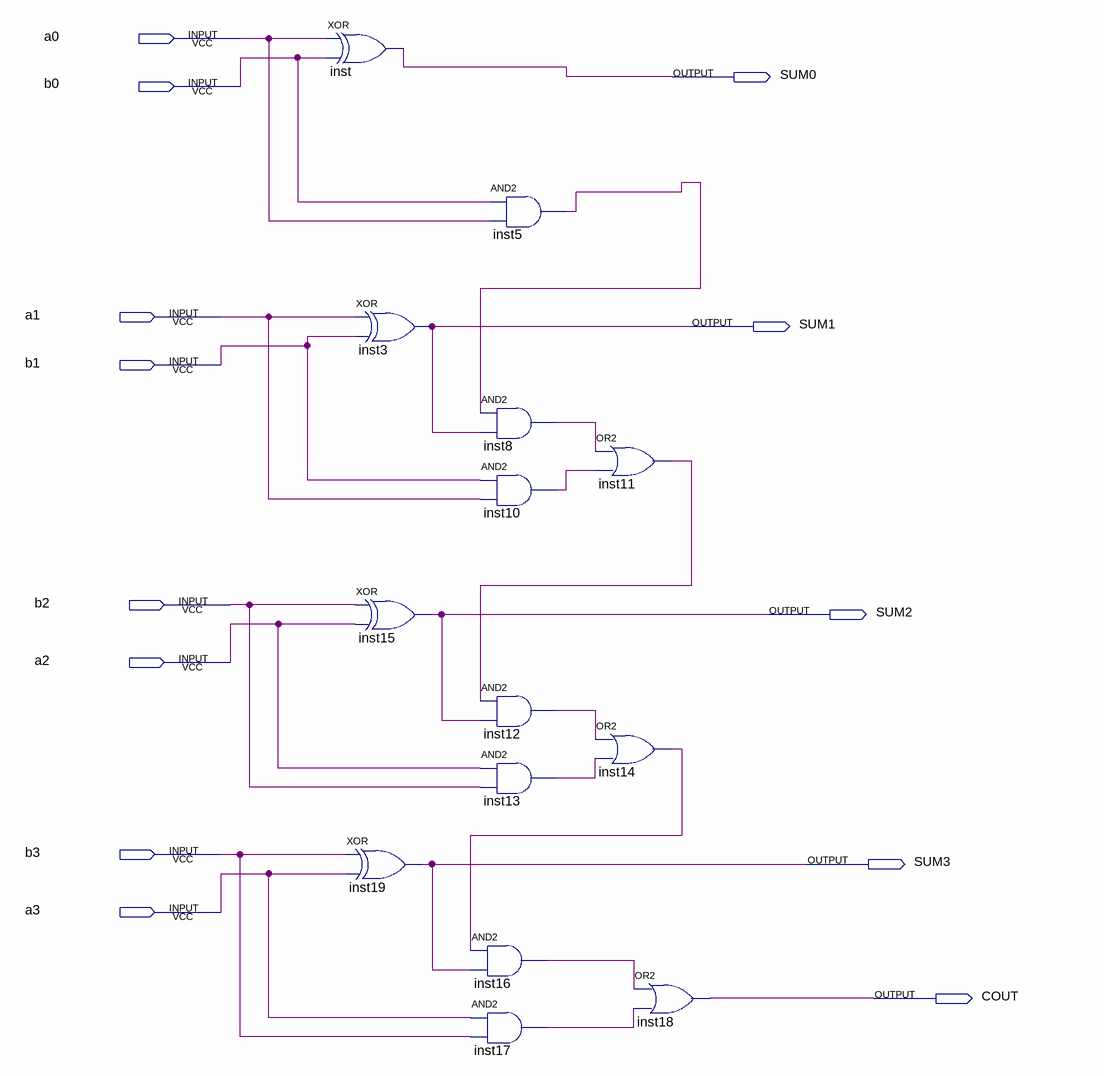
[diagram p0: schematic sheet]
// Quartus schematic Lab2(1).bdf as structural Verilog: 14 symbols, 13 pins
module \Lab2(1)  (
  input  a0,
  input  b0,
  input  a1,
  input  b1,
  input  b2,
  input  a2,
  input  b3,
  input  a3,
  output SUM0,
  output SUM1,
  output SUM2,
  output SUM3,
  output COUT
);

  wire inst5_out, inst8_out, inst10_out, inst11_out, inst12_out, inst13_out, inst14_out, inst16_out,
       inst17_out;

  xor inst (SUM0, a0, b0);
  xor inst19 (SUM3, b3, a3);
  xor inst3 (SUM1, a1, b1);
  xor inst15 (SUM2, b2, a2);
  and inst5 (inst5_out, b0, a0);
  and inst8 (inst8_out, inst5_out, SUM1);
  and inst10 (inst10_out, b1, a1);
  and inst12 (inst12_out, inst11_out, SUM2);
  and inst13 (inst13_out, a2, b2);
  and inst16 (inst16_out, inst14_out, SUM3);
  and inst17 (inst17_out, a3, b3);
  or inst11 (inst11_out, inst8_out, inst10_out);
  or inst14 (inst14_out, inst12_out, inst13_out);
  or inst18 (COUT, inst16_out, inst17_out);
endmodule
